# Altium schematic sheet Power_Supply.SchDoc: MesureTH
size 276 x 198 mm; Date: 21.08.2024; CheckedBy: CFO; DrawnBy: MPT; Organization: ETML-ES; Address1: Av. Recordon 1bis; Address2: 1004 Lausanne; Address3: Suisse; DocumentNumber: 2409; SheetNumber: 2; SheetTotal: 5; CheckingDate: 26.08.2024
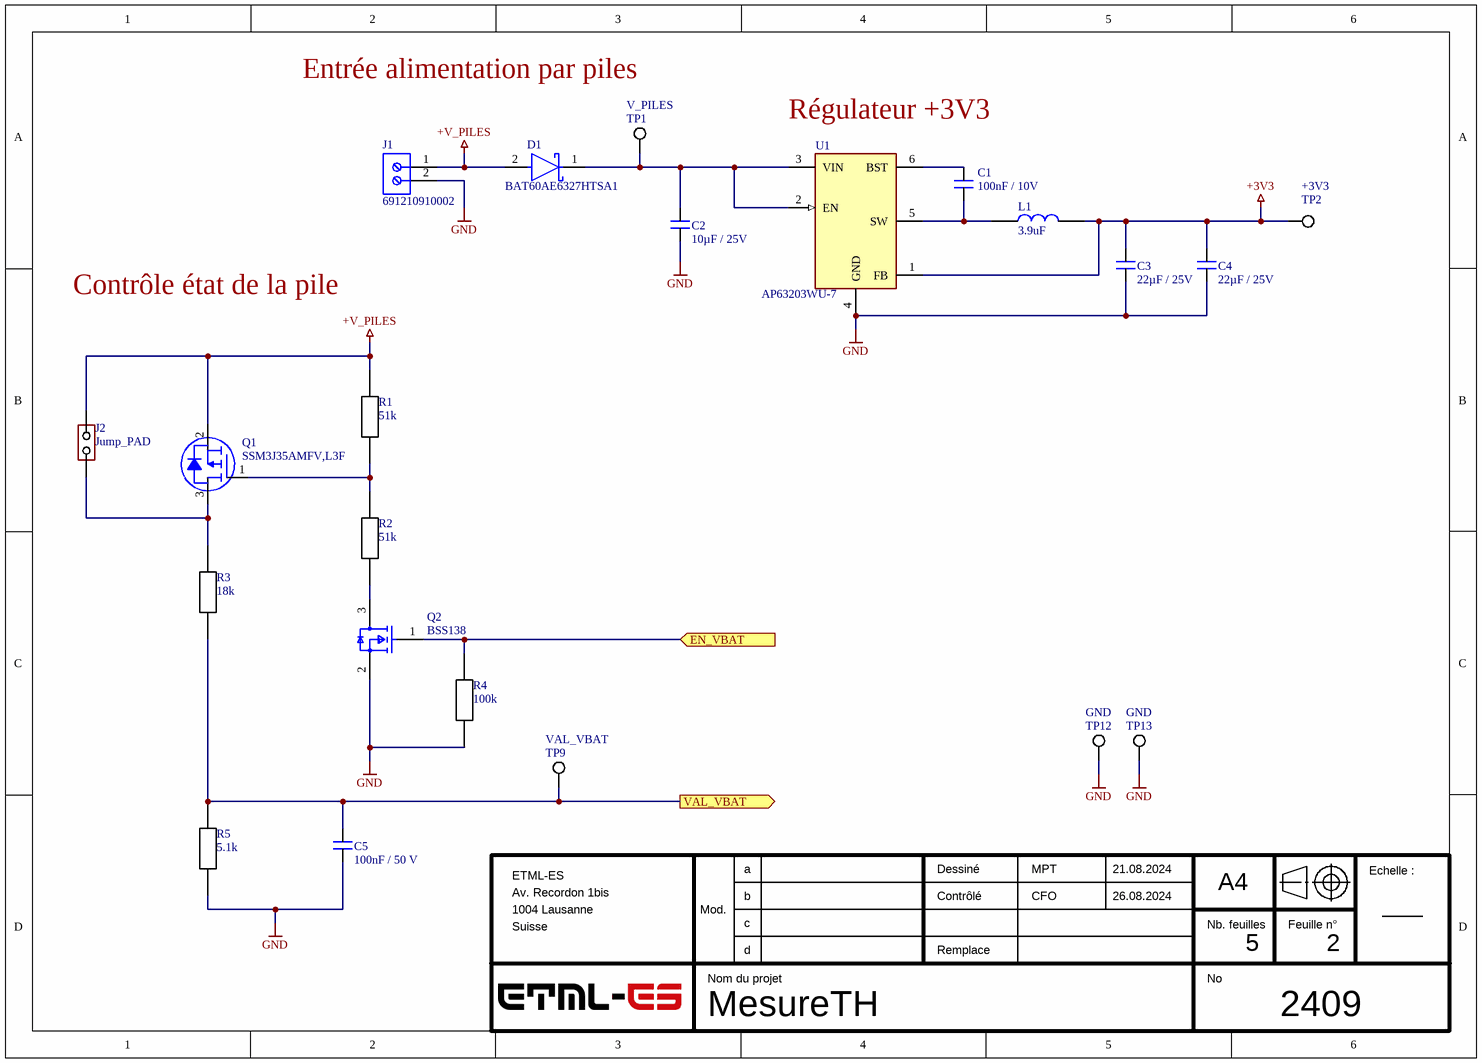
[diagram p0: Power_Supply.SchDoc]

## Parts
C1  100nF / 10V  [WCAP-CSGP_0805_L2W1.25H0.8_Wave]
C2  10µF / 25V  [WCAP-CSGP_0805_L2W1.25H0.8_Wave]
C3  22µF / 25V  [WCAP-CSGP_0805_L2W1.25H0.8_Wave]
C4  22µF / 25V  [WCAP-CSGP_0805_L2W1.25H0.8_Wave]
C5  100nF / 50 V  [WCAP-CSGP_0805_L2W1.25H0.8_Wave]
D1  BAT60AE6327HTSA1  [FP-PG-SOD323-2-IPC_C]
J1  691210910002  [691210910002]
J2  Jump_PAD  [Jump_PAD]
L1  3.9uF  [Inductance 3.9uF]
Q1  SSM3J35AMFV,L3F  [SSM3J35AMFV]
Q2  BSS138  [FP-318-08-IPC_B]
R1  51k  [WRIS-PSMB_0805_L2W1.25H0.35]
R2  51k  [WRIS-PSMB_0805_L2W1.25H0.35]
R3  18k  [WRIS-PSMB_0805_L2W1.25H0.35]
R4  100k  [WRIS-PSMB_0805_L2W1.25H0.35]
R5  5.1k  [WRIS-PSMB_0805_L2W1.25H0.35]
TP1  Test_Point_SMD  [5019]  (value not drawn)
TP2  Test_Point_SMD  [5019]  (value not drawn)
TP9  Test_Point_SMD  [5019]  (value not drawn)
TP12  Test_Point_SMD  [5019]  (value not drawn)
TP13  Test_Point_SMD  [5019]  (value not drawn)
U1  AP63203WU-7  [FP-TSOT26-MFG - duplicate]

## Ports
EN_VBAT (in), VAL_VBAT (out)

## Nets
+3V3: C3.1(+) C4.1(+) L1.2 TP2.1 U1.1(FB)
+V_PILES: D1.2(A) J1.1 J2.2 Q1.2(S) R1.2
GND: C2.2(-) C3.2(-) C4.2(-) C5.2(-) J1.2 Q2.2(S) R4.1 R5.1 TP12.1 TP13.1 U1.4(GND)
EN_VBAT: Q2.1(G) R4.2 ; port EN_VBAT
VAL_VBAT: C5.1(+) R3.1 R5.2 TP9.1 ; port VAL_VBAT
NetC1_1: C1.1(+) U1.6(BST)
NetC1_2: C1.2(-) L1.1 U1.5(SW)
NetC2_1: C2.1(+) D1.1(C) TP1.1 U1.2(EN) U1.3(VIN)
NetJ2_1: J2.1 Q1.3(D) R3.2
NetQ1_1: Q1.1(G) R1.1 R2.2
NetQ2_3: Q2.3(D) R2.1

## Notes on the sheet
- Entrée alimentation par piles
- (near TP1) V_PILES
- Régulateur +3V3
- (near TP2) +3V3
- Contrôle état de la pile
- (near TP9) VAL_VBAT
- (near TP12) GND
- GND
- a
- Dessiné
- A4
- Echelle :
- Mod.
- b
- c
- d
- Contrôlé
- Remplace
- Nb. feuilles
- Feuille n°
- Nom du projet
- No

## Library data of the parts
C1-C5 = CAPA: Tension: *
D1 = CMP-32890-000004-1: DIODE SCHOTTKY 10V 3A SOD323-2; Forward Voltage: 370mV; Polarity: Standard; Peak Non-Repetitive Surge Current: 5A; Element Configuration: Single; Max Operating Temperature: 85°C; Current Rating: 3A; Number of Pins: 2; Mount: Surface Mount; Forward Current: 3A; Max Reverse Voltage (DC): 10V; Output Current: 3A; Contact Plating: Tin; Average Rectified Current: 3A; Lead Free: Lead Free; Max Repetitive Reverse Voltage (Vrrm): 10V; Voltage Rating (DC): 10V; Radiation Hardening: No; Halogen Free: Not Halogen Free; Case/Package: SOD-323-2; REACH SVHC: No SVHC; Min Operating Temperature: -55°C; Packaging: Tape and Reel
J1 = CMP-1502-02456-2: NexarPartId: 105950649; Current Rating: 6A; Voltage Rating: 150V; Number of Contacts: 2; Number of Rows: 1; Contact Material: Tin; Height: 8.7mm; Max Operating Temperature: 105°C; Min Operating Temperature: -40°C
J2 = Jump_PAD: jump pad smd
L1 = Inductance 3.9uF: FIXED IND 3.9UH 850MA 200 MOHM; MF: EPCOS; MP: B82432T1392K000; SnapEDA_Link: https://www.snapeda.com/parts/B82432T1392K000/EPCOS/view-part/?ref=snap; Package: 1812 EPCOS (TDK); Value: *; Check_prices: https://www.snapeda.com/parts/B82432T1392K000/EPCOS/view-part/?ref=eda; Supplier 1: Digi-Key
Q1 = SSM3J35AMFV,L3F: Canal P 20 V 250mA (Ta) 150mW (Ta) Montage en surface VESM
Q2 = CMP-07173-000101-1: MOSFET N-CH 50V 220MA SOT-23; Turn-Off Delay Time: 20ns; Element Configuration: Single; Rds On Max: 3.5R; Gate to Source Voltage (Vgs): 20V; Threshold Voltage: 1.3V; Number of Elements: 1; Power Dissipation: 360mW; Rise Time: 9ns; Turn-On Delay Time: 2.5ns; Input Capacitance: 27pF; On-State Resistance: 6R; Lead Free: Lead Free; Length: 2.92mm; Width: 1.3mm; Drain to Source Breakdown Voltage: 50V; Min Operating Temperature: -55°C; REACH SVHC: No SVHC; Packaging: Tape and Reel; Radiation Hardening: No; Height: 0.93mm; Drain to Source Voltage (Vdss): 50V; Current Rating: 220mA; Voltage Rating (DC): 50V; Weight: 0.03g; Continuous Drain Current (ID): 220mA; Number of Pins: 3; Nominal Vgs: 1.3V; Max Power Dissipation: 360mW; Fall Time: 9ns; Drain to Source Resistance: 3.5R; Contact Plating: Tin; Case/Package: SOT-23; Package Quantity: 1; Dual Supply Voltage: 50V; Mount: Surface Mount; Termination: SMD/SMT; Max Operating Temperature: 150°C
R1-R5 = Resistance
U1 = Regulateur 3.3V: IC REG BUCK 3.3V 2A TSOT26; Manufacturer: Diodes Inc.; Output Type: Fixed; Min Supply Voltage: 3.8V; Number Of Outputs: 1; Max Junction Temp: +160°C; Nominal Supply Current: 22uA; Standoff Height: 0.01mm; Switching Frequency: 1.1MHz; Max Supply Voltage: 32V; ComponentLink2Description: Datasheet; Device Class L1: Integrated Circuits (ICs); Temperature: to +160°C; Device Class L3: Voltage Regulators - Switching; RoHS: TRUE; Octopart: https://octopart.com/ap63203wu-7-diodes+inc.-98099550; Output Voltage: 3.3V; Lead Free: Yes; ComponentLink2URL: https://www.diodes.com/assets/Datasheets/AP63200-AP63201-AP63203-AP63205.pdf; Digikey Description: IC REG BUCK 3.3V 2A TSOT26; Footprint Url: https://www.diodes.com/assets/Package-Files/TSOT26.pdf; Ambient Temperature Range High: +85°C; Height: 1mm; Automotive: No; Temperature Range High: +160°C; Switching Topology: Buck; Output Current: 2A; Package: TSOT26; Category: IC; Mouser Description: AP63203 Series 3.3 V 2 A SMT Fixed Low IQ Synchronous Buck - TSOT-26; Device Class L2: Power Management ICs; Ambient Temperature Range Low: -40°C; Manufacturer Part Number: AP63203WU-7